# Altium schematic sheet SH5 - LOAD MONITORING 1.SchDoc: Load Monitoring 1
size B; CheckedBy: Cindy Li; Engineer: Farris Matar; Organization: UW Robotics; Address1: 200 University Avenue; Address2: Waterloo; Address3: Ontario; Address4: Canada N2L 3G6; DocumentNumber: 5; Revision: 3; SheetNumber: 5; SheetTotal: 9
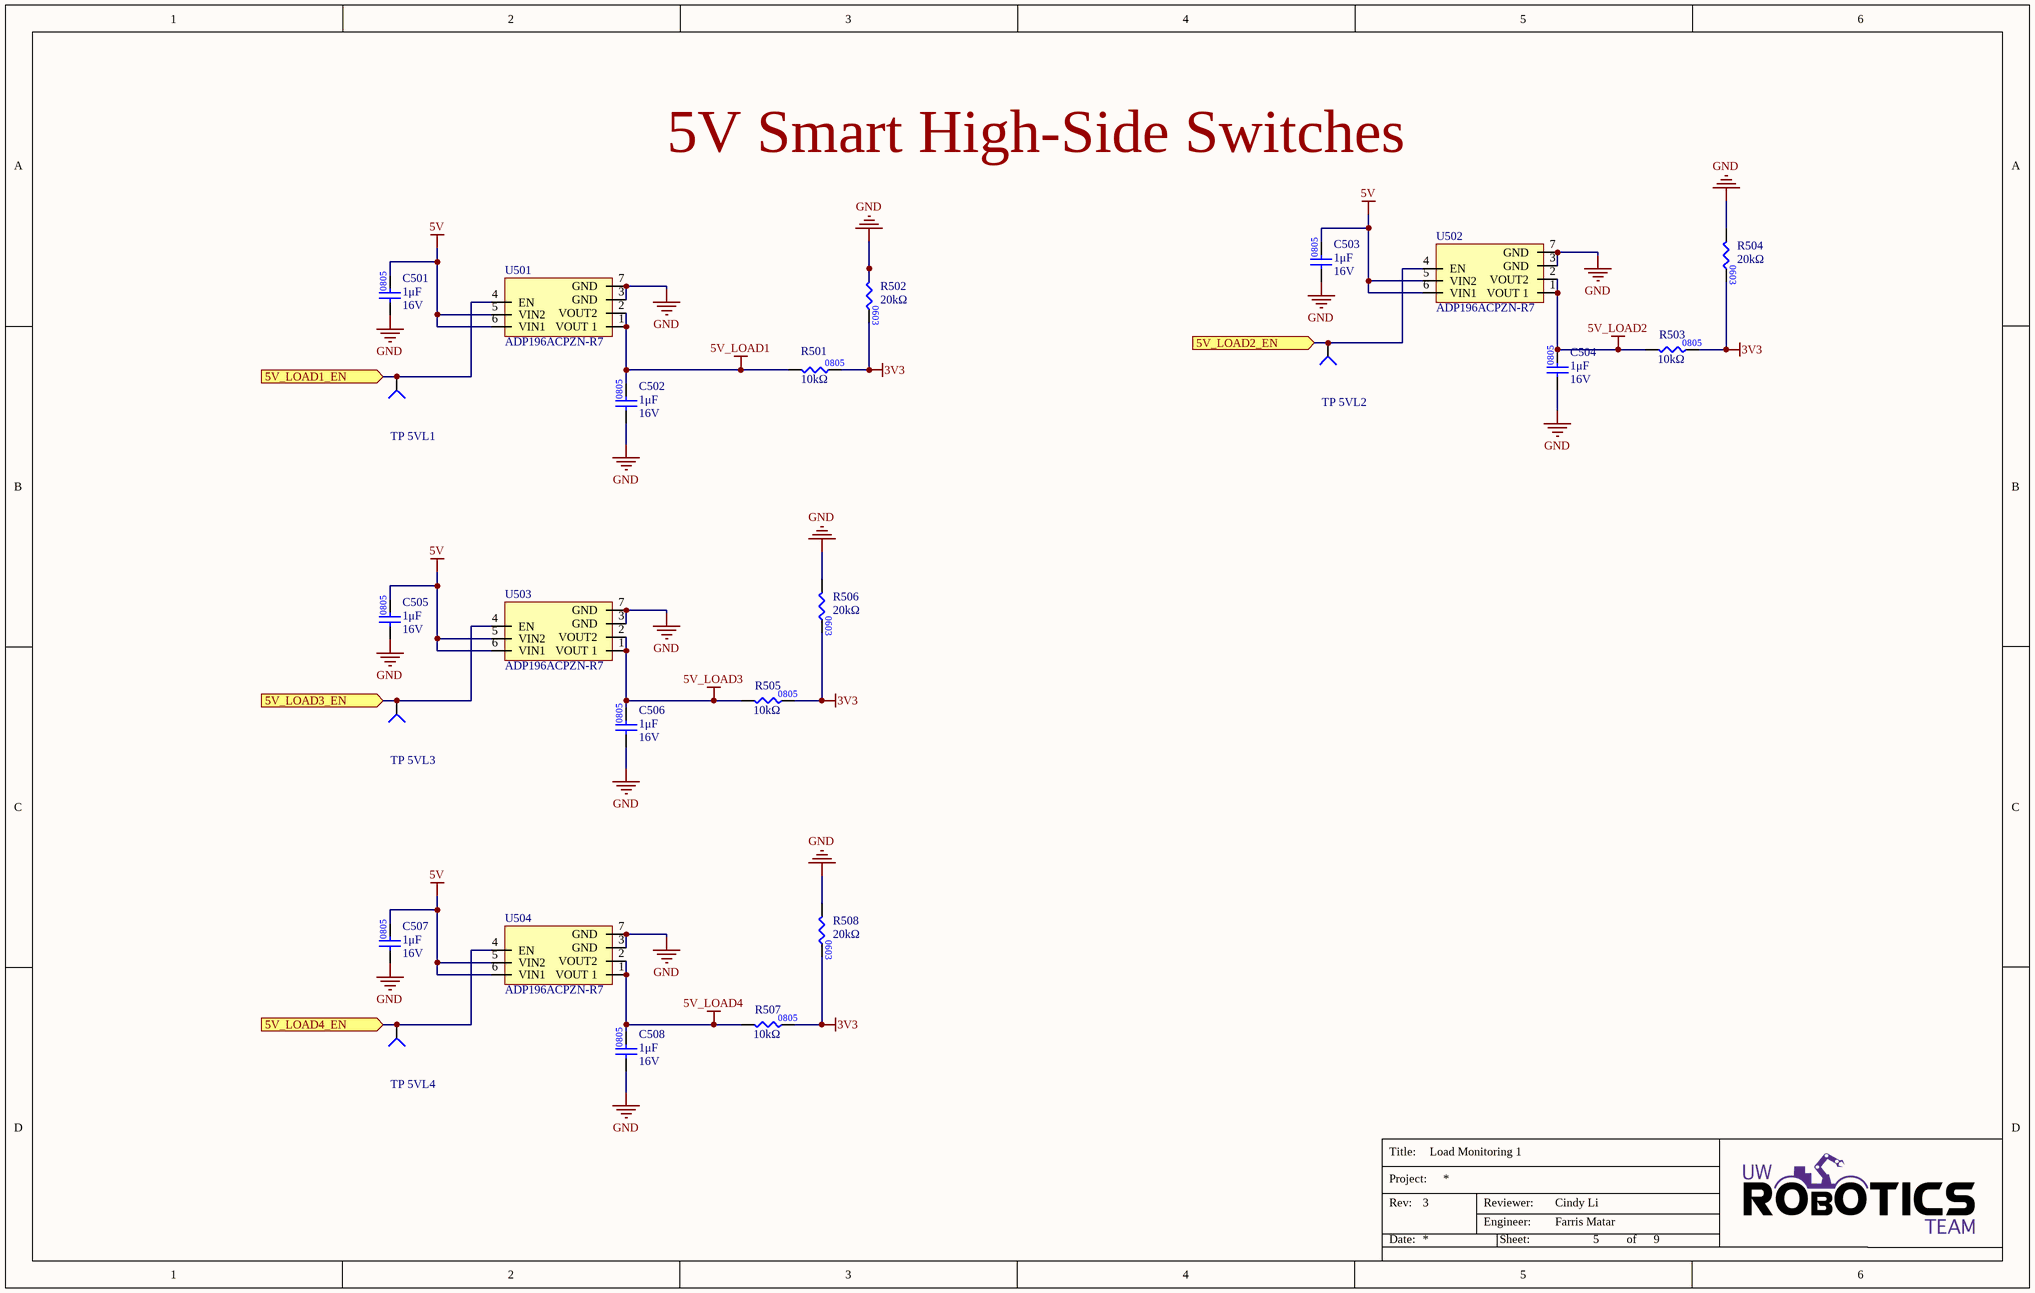
[diagram p0: SH5 - LOAD MONITORING 1.SchDoc]

## Parts
C501  value 1μF  Voltage Rating: 16V  [CAP0805]  (hidden comment: CAP_1uF_16V_0805)
C502  value 1μF  Voltage Rating: 16V  [CAP0805]  (hidden comment: CAP_1uF_16V_0805)
C503  value 1μF  Voltage Rating: 16V  [CAP0805]  (hidden comment: CAP_1uF_16V_0805)
C504  value 1μF  Voltage Rating: 16V  [CAP0805]  (hidden comment: CAP_1uF_16V_0805)
C505  value 1μF  Voltage Rating: 16V  [CAP0805]  (hidden comment: CAP_1uF_16V_0805)
C506  value 1μF  Voltage Rating: 16V  [CAP0805]  (hidden comment: CAP_1uF_16V_0805)
C507  value 1μF  Voltage Rating: 16V  [CAP0805]  (hidden comment: CAP_1uF_16V_0805)
C508  value 1μF  Voltage Rating: 16V  [CAP0805]  (hidden comment: CAP_1uF_16V_0805)
R501  value 10kΩ  [RES0805]  (hidden comment: RES_10kΩ_0805_5%)
R502  value 20kΩ  [RES0603]  (hidden comment: RES_20kΩ_0603_1%)
R503  value 10kΩ  [RES0805]  (hidden comment: RES_10kΩ_0805_5%)
R504  value 20kΩ  [RES0603]  (hidden comment: RES_20kΩ_0603_1%)
R505  value 10kΩ  [RES0805]  (hidden comment: RES_10kΩ_0805_5%)
R506  value 20kΩ  [RES0603]  (hidden comment: RES_20kΩ_0603_1%)
R507  value 10kΩ  [RES0805]  (hidden comment: RES_10kΩ_0805_5%)
R508  value 20kΩ  [RES0603]  (hidden comment: RES_20kΩ_0603_1%)
TP_5VL1  TESTPOINT_1MM_CIRCLE  [TESTPOINT_CIRCLE_1MM]  (value not drawn)  (no BOM)
TP_5VL2  TESTPOINT_1MM_CIRCLE  [TESTPOINT_CIRCLE_1MM]  (value not drawn)  (no BOM)
TP_5VL3  TESTPOINT_1MM_CIRCLE  [TESTPOINT_CIRCLE_1MM]  (value not drawn)  (no BOM)
TP_5VL4  TESTPOINT_1MM_CIRCLE  [TESTPOINT_CIRCLE_1MM]  (value not drawn)  (no BOM)
U501  Supplier Part Number 1: ADP196ACPZN-R7  [CP_6_3_ADI-M]  (hidden comment: IC_PWR_SWTICH_5V)
U502  Supplier Part Number 1: ADP196ACPZN-R7  [CP_6_3_ADI-M]  (hidden comment: IC_PWR_SWTICH_5V)
U503  Supplier Part Number 1: ADP196ACPZN-R7  [CP_6_3_ADI-M]  (hidden comment: IC_PWR_SWTICH_5V)
U504  Supplier Part Number 1: ADP196ACPZN-R7  [CP_6_3_ADI-M]  (hidden comment: IC_PWR_SWTICH_5V)

## Ports
5V_LOAD1_EN (in), 5V_LOAD2_EN (in), 5V_LOAD3_EN (in), 5V_LOAD4_EN (in)

## Nets
3V3: R501.2 R502.2 R503.2 R504.2 R505.2 R506.2 R507.2 R508.2
5V: C501.2 C503.2 C505.2 C507.2 U501.5(VIN2) U501.6(VIN1) U502.5(VIN2) U502.6(VIN1) U503.5(VIN2) U503.6(VIN1) U504.5(VIN2) U504.6(VIN1)
5V_LOAD1: C502.2 R501.1 U501.1(VOUT_1) U501.2(VOUT2)
5V_LOAD2: C504.2 R503.1 U502.1(VOUT_1) U502.2(VOUT2)
5V_LOAD3: C506.2 R505.1 U503.1(VOUT_1) U503.2(VOUT2)
5V_LOAD4: C508.2 R507.1 U504.1(VOUT_1) U504.2(VOUT2)
GND: C501.1 C502.1 C503.1 C504.1 C505.1 C506.1 C507.1 C508.1 R502.1 R504.1 R506.1 R508.1 U501.3(GND) U501.7(GND) U502.3(GND) U502.7(GND) U503.3(GND) U503.7(GND) U504.3(GND) U504.7(GND)
5V_LOAD1_EN: TP_5VL1.1(=value) U501.4(EN) ; port 5V_LOAD1_EN
5V_LOAD2_EN: TP_5VL2.1(=value) U502.4(EN) ; port 5V_LOAD2_EN
5V_LOAD3_EN: TP_5VL3.1(=value) U503.4(EN) ; port 5V_LOAD3_EN
5V_LOAD4_EN: TP_5VL4.1(=value) U504.4(EN) ; port 5V_LOAD4_EN

## Notes on the sheet
- 5V Smart High-Side Switches
- Title:
- Project:
- Date:
- Rev:
- Reviewer:
- Engineer:
- Sheet:
- of
- (in symbol RES_20kΩ_0603_1%) 0603

## Library data of the parts
C501-C508 = CAP_1uF_16V_0805: CAP CER 1UF 16V X7R 0805; Manufacturer 1: Yageo; Manufacturer Part Number 1: CC0805KKX7R7BB105; Mounting Type: SMD; Supplier 1: Digi-Key; Supplier Part Number 1: 311-1365-1-ND; Package: 0805; Dielectric: X7R
R501 R503 R505 R507 = RES_10kΩ_0805_5%: RES 10K OHM 5% 1/8W 0805; Manufacturer 1: Panasonic Electronic Components; Manufacturer Part Number 1: ERJ-6GEYJ103V; Package/Footprint: 0805; Supplier 1: Digi-Key; Supplier Part Number 1: P10KACT-ND; LCSC Part #: C17414; Mounting Type: SMD
R502 R504 R506 R508 = RES_20kΩ_0603_1%: RES 20K OHM 1% 1/10W 0603; Manufacturer 1: Yageo; Manufacturer Part Number 1: RC0603FR-0720KL; Supplier Part Number 1: 311-20.0KHRCT-ND; Supplier 1: Digi-Key
TP_5VL1-TP_5VL4 = TESTPOINT_1MM_CIRCLE: TESTPOINT 1MM CIRCLE
U501-U504 = IC_PWR_SWTICH_5V: IC PWR SWITCH N-CHAN 1:1 6LFCSP; Manufacturer 1: Analog Devices Inc.; Package/Footprint: 6-UDFN Exposed Pad, CSP; Manufacturer Part Number 1: ADP196ACPZN-R7; Mounting Type: SMD; Supplier 1: Arrow Electronics